# Altium project Stepper Motor Driver With L297 - l6201PS.PrjPCB
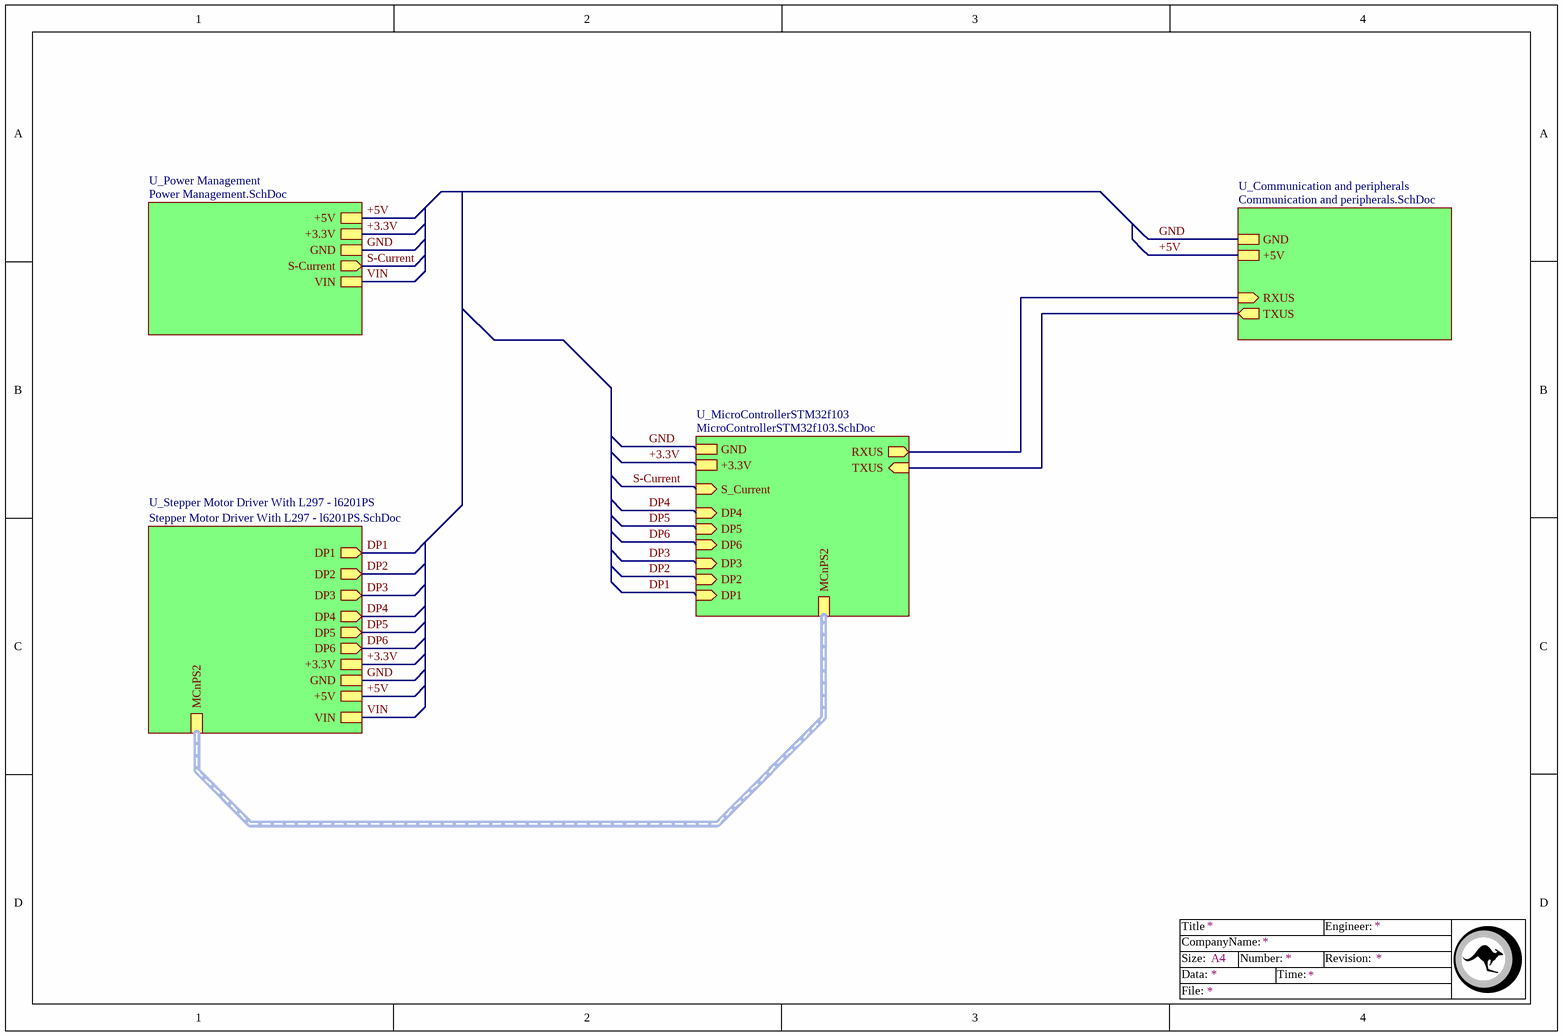
[diagram p0: A dashBoard of Stepper Motor Driver With L297 - l6201PS.SchDoc]
5 sheets, 90 parts. Net scope: hierarchical (ports join the sheet entries above them; power ports are global).
Board file: Stepper Motor Driver With L297 - l6201PS.PcbDoc
Sheets:
  A dashBoard of Stepper Motor Driver With L297 - l6201PS.SchDoc
    U_Communication and peripherals = Communication and peripherals.SchDoc
    U_Power Management = Power Management.SchDoc
    U_MicroControllerSTM32f103 = MicroControllerSTM32f103.SchDoc
    U_Stepper Motor Driver With L297 - l6201PS = Stepper Motor Driver With L297 - l6201PS.SchDoc

## Sheet A dashBoard of Stepper Motor Driver With L297 - l6201PS.SchDoc
size A4

### Sub-sheets
U_Communication and peripherals = Communication and peripherals.SchDoc: TXUS (out), RXUS (in), GND, +5V
U_MicroControllerSTM32f103 = MicroControllerSTM32f103.SchDoc: GND, +3.3V, RXUS (out), TXUS (in), DP4 (in), DP5 (in), DP6 (in), DP2 (in), DP1 (in), DP3 (in), MCnPS2 (harness MCnPS2), S_Current (in)
U_Power Management = Power Management.SchDoc: +5V, +3.3V, GND, S-Current (out), VIN
U_Stepper Motor Driver With L297 - l6201PS = Stepper Motor Driver With L297 - l6201PS.SchDoc: VIN, DP4 (out), DP5 (out), DP6 (out), GND, +3.3V, +5V, DP2 (out), DP1 (out), DP3 (out), MCnPS2 (harness MCnPS2)

### Nets
+3.3V: sheet U_Power Management/+3.3V, sheet U_MicroControllerSTM32f103/+3.3V, sheet U_Stepper Motor Driver With L297 - l6201PS/+3.3V
+5V: sheet U_Communication and peripherals/+5V, sheet U_Power Management/+5V, sheet U_Stepper Motor Driver With L297 - l6201PS/+5V
GND: sheet U_Communication and peripherals/GND, sheet U_Power Management/GND, sheet U_MicroControllerSTM32f103/GND, sheet U_Stepper Motor Driver With L297 - l6201PS/GND
VIN: sheet U_Power Management/VIN, sheet U_Stepper Motor Driver With L297 - l6201PS/VIN
DP1: sheet U_MicroControllerSTM32f103/DP1, sheet U_Stepper Motor Driver With L297 - l6201PS/DP1
DP2: sheet U_MicroControllerSTM32f103/DP2, sheet U_Stepper Motor Driver With L297 - l6201PS/DP2
DP3: sheet U_MicroControllerSTM32f103/DP3, sheet U_Stepper Motor Driver With L297 - l6201PS/DP3
DP4: sheet U_MicroControllerSTM32f103/DP4, sheet U_Stepper Motor Driver With L297 - l6201PS/DP4
DP5: sheet U_MicroControllerSTM32f103/DP5, sheet U_Stepper Motor Driver With L297 - l6201PS/DP5
DP6: sheet U_MicroControllerSTM32f103/DP6, sheet U_Stepper Motor Driver With L297 - l6201PS/DP6
RXUS: sheet U_Communication and peripherals/RXUS, sheet U_MicroControllerSTM32f103/RXUS
S-Current: sheet U_Power Management/S-Current, sheet U_MicroControllerSTM32f103/S_Current
TXUS: sheet U_Communication and peripherals/TXUS, sheet U_MicroControllerSTM32f103/TXUS

### Buses and harness runs
harness sheet U_MicroControllerSTM32f103/MCnPS2 = sheet U_Stepper Motor Driver With L297 - l6201PS/MCnPS2

### Notes on the sheet
- Title
- Size:
- Data:
- CompanyName:
- A4
- Number:
- Time:
- Revision:
- Engineer:
- File:

## Sheet Communication and peripherals.SchDoc
size A4
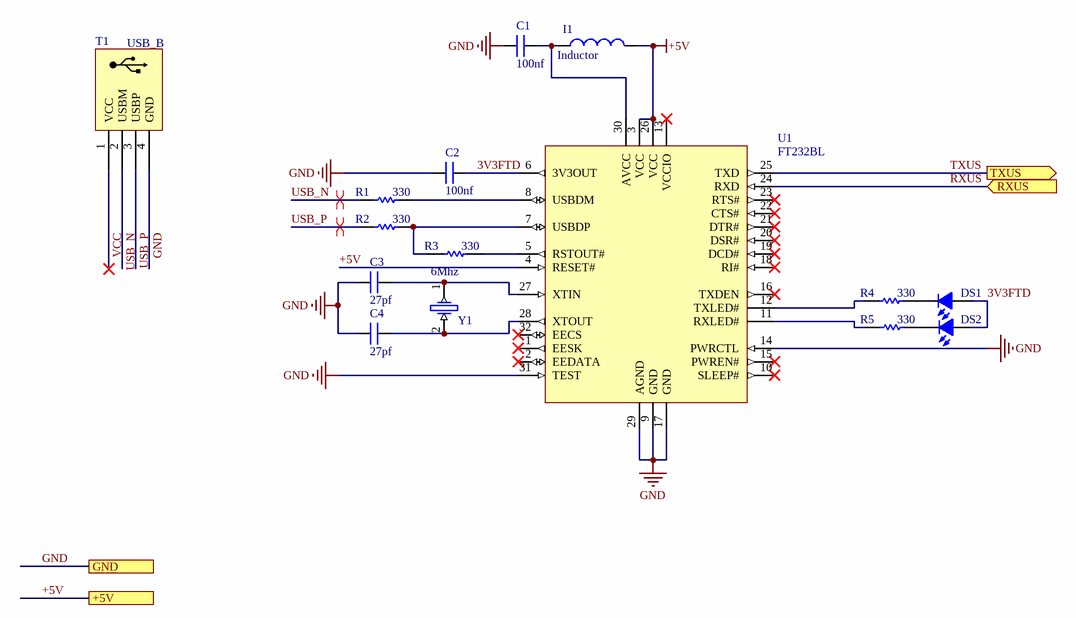
[diagram p1: Communication and peripherals.SchDoc]

### Parts
C1  100nf  [Cap0805]
C2  100nf  [Cap0805]
C3  27pf  [Cap0805]
C4  27pf  [Cap0805]
DS1  LED  [Led0805]  (value not drawn)
DS2  LED  [Led0805]  (value not drawn)
I1  Inductor  [1206]
R1  330  [R0805]
R2  330  [R0805]
R3  330  [R0805]
R4  330  [R0805]
R5  330  [R0805]
T1  USB_B  [USB_Dip_R]
U1  FT232BL  [LQFP-32_L]
Y1  6Mhz  [CrystallB]

### Ports
+5V, GND, RXUS (in), TXUS (out)

### Nets
+5V: I1.2 U1.3(VCC) U1.4(RESET#) U1.26(VCC) ; port +5V
GND: C1.2 C2.2 C3.1 C4.1 T1.4(GND) U1.9(GND) U1.14(PWRCTL) U1.17(GND) U1.29(AGND) U1.31(TEST) ; port GND
3V3FTD: C2.1 DS1.A DS2.A U1.6(3V3OUT)
RXUS: U1.24(RXD) ; port RXUS
TXUS: U1.25(TXD) ; port TXUS
USB_N: R1.1 T1.2(USBM)
USB_P: R2.1 T1.3(USBP)
VCC: T1.1(VCC)
NetC1_1: C1.1 I1.1 U1.30(AVCC)
NetC3_2: C3.2 U1.27(XTIN) Y1.1
NetC4_2: C4.2 U1.28(XTOUT) Y1.2
NetDS1_K: DS1.K R4.2
NetDS2_K: DS2.K R5.2
NetR1_2: R1.2 U1.8(USBDM)
NetR2_2: R2.2 R3.1 U1.7(USBDP)
NetR3_2: R3.2 U1.5(RSTOUT#)
NetR4_1: R4.1 U1.12(TXLED#)
NetR5_1: R5.1 U1.11(RXLED#)

Not connected (* = marked no-connect by the designer): U1 1(EESK)* 2(EEDATA)* 10(SLEEP#)* 13(VCCIO)* 15(PWREN#)* 16(TXDEN)* 18(RI#)* 19(DCD#)* 20(DSR#)* 21(DTR#)* 22(CTS#)* 23(RTS#)* 32(EECS)*

### Layout directives
differential pair: USB_N, USB_P

### Notes on the sheet
- Title
- Size:
- Data:
- CompanyName:
- A4
- Number:
- Time:
- Revision:
- Engineer:
- File:

### Library data of the parts
C1-C4 = Cap: Surface mount Capacitor
I1 = Inductor: Indicator
R1-R5 = Resistor
T1 = USB_B: USB B Connector
U1 = FT232BL: USB UART Asynchronous Serial Data Transfer Chip, LQFP-32, Pb-Free; DatasheetVersion: ver 2.2, Nov-2011; PackageVersion: 2010; PackageReference: LQFP-32; PackageDescription: 32-Pin Thin Quad Flat Pack 0.8 mm Pitch; ComponentLink1Description: Manufacturer URL; ComponentLink1URL: http://www.ftdichip.com/; ComponentLink2Description: Datasheet; ComponentLink2URL: http://www.ftdichip.com/Support/Documents/DataSheets/ICs/DS_FT232BL_BQ.pdf
Y1 = Crystal

## Sheet Power Management.SchDoc
size A4
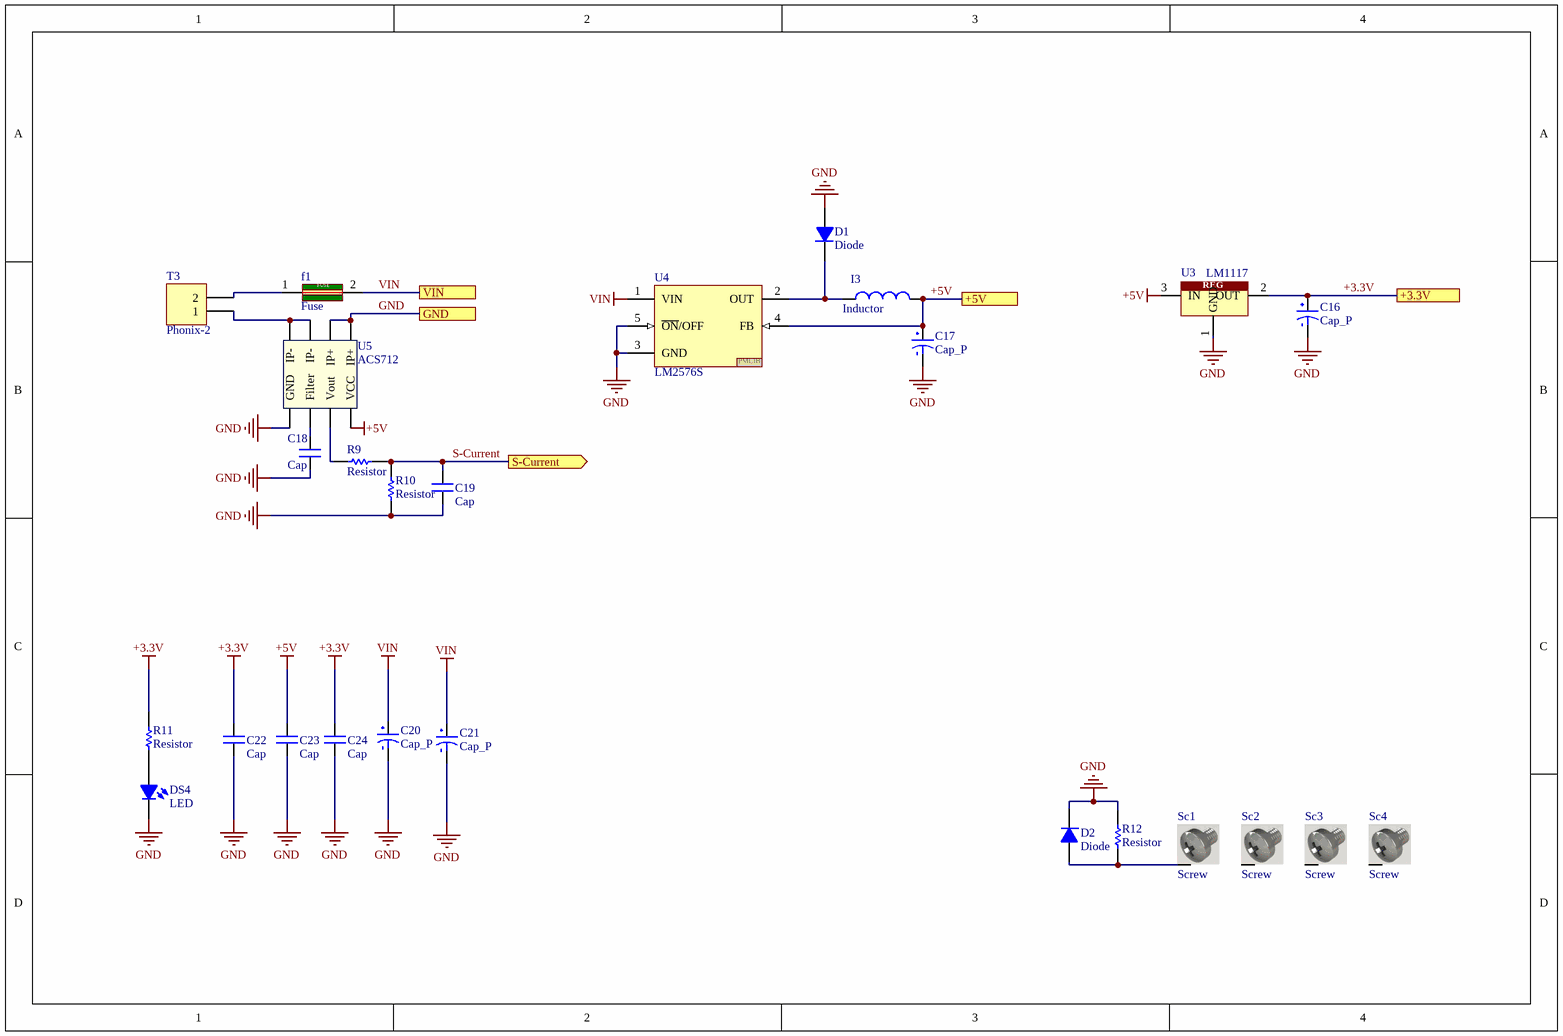
[diagram p2: Power Management.SchDoc]

### Parts
C16  Cap_P  [Cap_4mm]
C17  Cap_P  [Cap_4mm]
C18  Cap  [Cap0805]
C19  Cap  [Cap0805]
C20  Cap_P  [Cap_5mm]
C21  Cap_P  [Cap_5mm]
C22  Cap  [Cap0805]
C23  Cap  [Cap0805]
C24  Cap  [Cap0805]
D1  Diode  [Diod-1A-SMD]
D2  Diode  [Diod-1A-SMD]
DS4  LED  [Led0805]
f1  Fuse  [1206]
I3  Inductor  [Indicator_SMD]
R9  Resistor  [R0805]
R10  Resistor  [R0805]
R11  Resistor  [R0805]
R12  Resistor  [0603]
Sc1  Screw  [Screw]
Sc2  Screw  [Screw]
Sc3  Screw  [Screw]
Sc4  Screw  [Screw]
T3  Phonix-2  [Phonix-2]
U3  LM1117  [DPACK]
U4  LM2576S  [LM2576S]
U5  ACS712  [SOP8]

### Ports
+3.3V, +5V, GND, S-Current (out), VIN

### Nets
+3.3V: C16.2 C22.2 C24.2 R11.1 U3.2(OUT) ; port +3.3V
+5V: C17.2 C23.2 I3.2 U3.3(IN) U4.4(FB) U5.8(VCC) ; port +5V
GND: C16.1 C17.1 C18.1 C19.1 C20.1 C21.1 C22.1 C23.1 C24.1 D1.A D2.K DS4.K R10.2 R12.1 U3.1(GND) U4.3(GND) U4.5(~{ON}/OFF) U5.1(IP+) U5.2(IP+) U5.5(GND) ; port GND
VIN: C20.2 C21.2 f1.2(OUT) U4.1(VIN) ; port VIN
S-Current: C19.2 R9.1 R10.1 ; port S-Current
NetC18_2: C18.2 U5.6(Filter)
NetD1_K: D1.K I3.1 U4.2(OUT)
NetD2_A: D2.A R12.2 Sc1.S
NetDS4_A: DS4.A R11.2
Netf1_1: f1.1(IN) T3.2
NetR9_2: R9.2 U5.7(Vout)
NetT3_1: T3.1 U5.3(IP-) U5.4(IP-)

Not connected (* = marked no-connect by the designer): Sc2 S; Sc3 S; Sc4 S

### Notes on the sheet
- Title
- Size:
- Data:
- CompanyName:
- A4
- Number:
- Time:
- Revision:
- Engineer:
- File:
- (in symbol Fuse) FUSE
- (in symbol LM1117) REG
- (in symbol LM2576S) PMLIB

### Library data of the parts
C16 C17 C20 C21 = Cap_P: Polarity
C18 C19 C22-C24 = Cap: Surface mount Capacitor
I3 = Inductor: Indicator
Sc1-Sc4 = Screw: Screw 3mm
T3 = Phonix-2: Connector
U3 = LM1117: Regulator
U4 = LM2576S: Regulator
U5 = ACS712: Hall effect Current Sensor

## Sheet MicroControllerSTM32f103.SchDoc
size A4
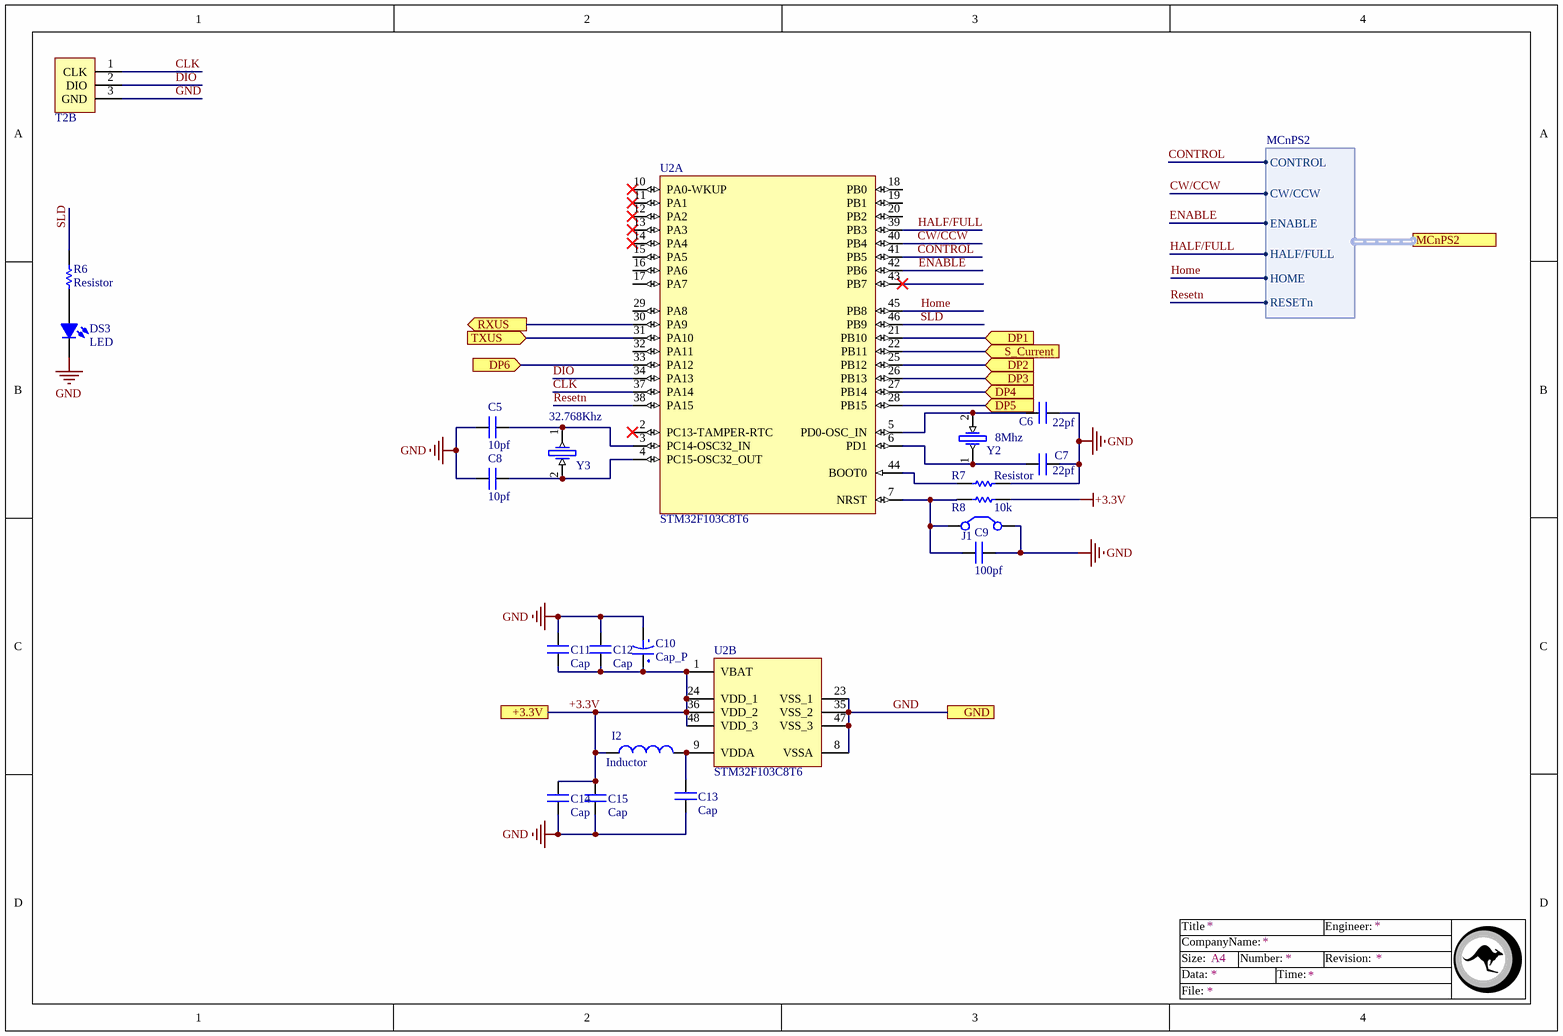
[diagram p3: MicroControllerSTM32f103.SchDoc]

### Parts
C5  10pf  [Cap0805]
C6  22pf  [Cap0805]
C7  22pf  [Cap0805]
C8  10pf  [Cap0805]
C9  100pf  [Cap0805]
C10  Cap_P  [CAPMOL_C]
C11  Cap  [Cap0805]
C12  Cap  [Cap0805]
C13  Cap  [Cap0805]
C14  Cap  [Cap0805]
C15  Cap  [Cap0805]
DS3  LED  [Led0805]
I2  Inductor  [1206]
J1  Jumper  [Jumper SMD - Small]  (value not drawn)
R6  Resistor  [R0805]
R7  Resistor  [R0805]
R8  10k  [R0805]
T2  Serial Program  [MHDR1X03-254P - E]  (value not drawn)  (part B of 2)
U2  STM32F103C8T6  [LQFP48_L]  (parts A,B of 2)
Y2  8Mhz  [CrystallB]
Y3  32.768Khz  [CrystallB]

### Ports
+3.3V, DP1 (in), DP2 (in), DP3 (in), DP4 (in), DP5 (in), DP6 (in), GND, MCnPS2 (harness MCnPS2), RXUS (out), S_Current (in), TXUS (in)

### Harnesses
MCnPS2: CONTROL, CW/CCW, ENABLE, HALF/FULL, HOME, RESETn

### Nets
+3.3V: C10.2 C11.1 C12.1 C14.2 C15.2 I2.1 R8.1 U2.1(VBAT) U2.24(VDD_1) U2.36(VDD_2) U2.48(VDD_3) ; port +3.3V
GND: C5.1 C6.1 C7.1 C8.1 C9.2 C10.1 C11.2 C12.2 C13.1 C14.1 C15.1 DS3.K J1.2(C2) R7.2 T2.3(GND) U2.8(VSSA) U2.23(VSS_1) U2.35(VSS_2) U2.47(VSS_3) ; port GND
CLK: T2.1(CLK) U2.37(PA14)
CONTROL: U2.41(PB5) ; port MCnPS2.CONTROL
CW/CCW: U2.40(PB4) ; port MCnPS2.CW/CCW
DIO: T2.2(DIO) U2.34(PA13)
DP1: U2.21(PB10) ; port DP1
DP2: U2.25(PB12) ; port DP2
DP3: U2.26(PB13) ; port DP3
DP4: U2.27(PB14) ; port DP4
DP5: U2.28(PB15) ; port DP5
DP6: U2.33(PA12) ; port DP6
ENABLE: U2.42(PB6) ; port MCnPS2.ENABLE
HALF/FULL: U2.39(PB3) ; port MCnPS2.HALF/FULL
Home: U2.45(PB8) ; port MCnPS2.HOME
Resetn: U2.38(PA15) ; port MCnPS2.RESETn
RXUS: U2.30(PA9) ; port RXUS
S-Current: U2.22(PB11) ; port S_Current
SLD: R6.1 U2.46(PB9)
TXUS: U2.31(PA10) ; port TXUS
NetC5_2: C5.2 U2.3(PC14-OSC32_IN) Y3.1
NetC6_2: C6.2 U2.5(PD0-OSC_IN) Y2.2
NetC7_2: C7.2 U2.6(PD1) Y2.1
NetC8_2: C8.2 U2.4(PC15-OSC32_OUT) Y3.2
NetC9_1: C9.1 J1.1(C1) R8.2 U2.7(NRST)
NetC13_2: C13.2 I2.2 U2.9(VDDA)
NetDS3_A: DS3.A R6.2
NetR7_1: R7.1 U2.44(BOOT0)

Not connected (* = marked no-connect by the designer): U2 2(PC13-TAMPER-RTC)* 10(PA0-WKUP)* 11(PA1)* 12(PA2)* 13(PA3)* 14(PA4)* 15(PA5) 16(PA6) 17(PA7) 18(PB0) 19(PB1) 20(PB2) 29(PA8) 32(PA11) 43(PB7)*

### Notes on the sheet
- Title
- Size:
- Data:
- CompanyName:
- A4
- Number:
- Time:
- Revision:
- Engineer:
- File:

### Library data of the parts
C5-C9 C11-C15 = Cap: Surface mount Capacitor
C10 = Cap_P: Polarity
I2 = Inductor: Indicator
R8 = Resistor
T2 = Serial Program: STM Serial Program pin
U2 = STM32F103C8T6: STM32 ARM-based 32-bit MCU Performance Line with 64 kB Flash, 20 kB Internal RAM, -40 to +85°C Temperature, 48-Pin LQFP, Tray; DatasheetVersion: rev13.0, Apr-2011; PackageVersion: rev13, Apr-2011; PackageReference: LQFP48; PackageDescription: 48-Pin Low-Profile Quad Flat Pack, 7 x 7 mm Body, 0.5 mm Pitch (LQFP48); ComponentLink1Description: Manufacturer URL; ComponentLink1URL: http://www.st.com/; ComponentLink2Description: STM32F103 Datasheet; ComponentLink2URL: http://www.st.com/internet/com/TECHNICAL_RESOURCES/TECHNICAL_LITERATURE/DATASHEET/CD00161566.pdf; ComponentLink3Description: STM32 Family Web Page; ComponentLink3URL: www.st.com/stm32
Y2 Y3 = Crystal

## Sheet Stepper Motor Driver With L297 - l6201PS.SchDoc
size A4
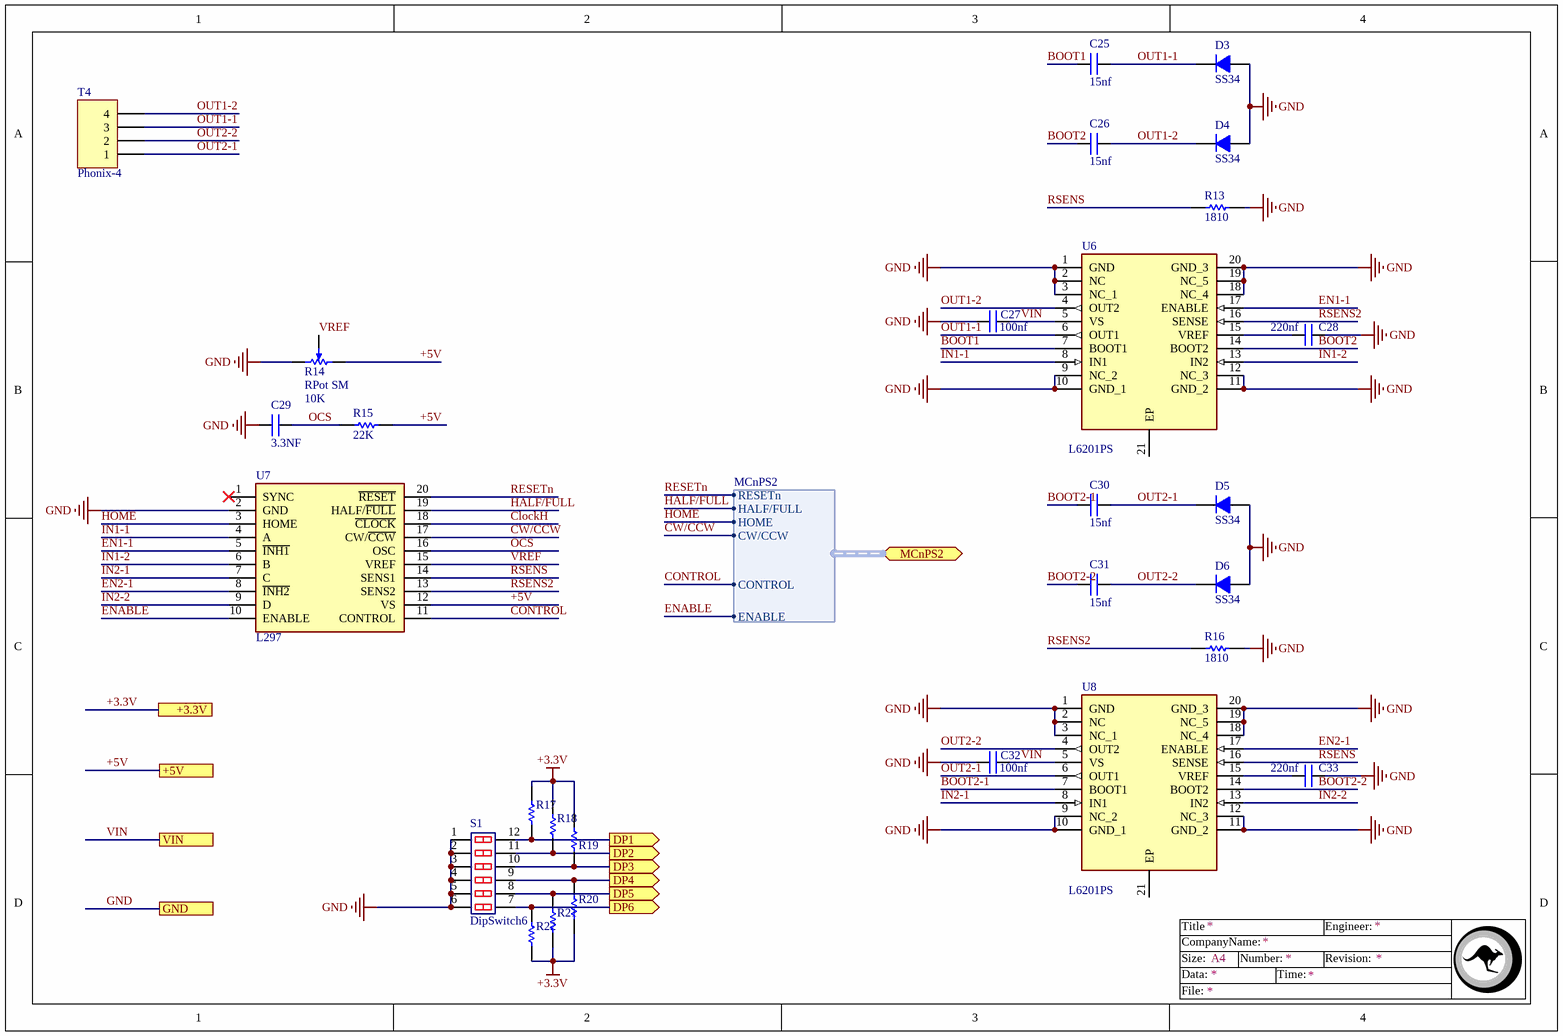
[diagram p4: Stepper Motor Driver With L297 - l6201PS.SchDoc]

### Parts
C25  15nf  [Cap0805]
C26  15nf  [Cap0805]
C27  100nf  [Cap0805]
C28  220nf  [Cap0805]
C29  3.3NF  [Cap0805]
C30  15nf  [Cap0805]
C31  15nf  [Cap0805]
C32  100nf  [Cap0805]
C33  220nf  [Cap0805]
D3  SS34  [Diod-1A-SMD]
D4  SS34  [Diod-1A-SMD]
D5  SS34  [Diod-1A-SMD]
D6  SS34  [Diod-1A-SMD]
R13  1810  [RES1812]
R14  RPot SM  value 10K  [POT4MM-Small Pot]
R15  22K  [R0805]
R16  1810  [RES1812]
R17  Resistor  [R0805]  (value not drawn)
R18  Resistor  [R0805]  (value not drawn)
R19  Resistor  [R0805]  (value not drawn)
R20  Resistor  [R0805]  (value not drawn)
R21  Resistor  [R0805]  (value not drawn)
R22  Resistor  [R0805]  (value not drawn)
S1  DipSwitch6  [DIPSW6]
T4  Phonix-4  [Phonix-4]
U6  L6201PS  [SOIC127P1420X360-21N]
U7  L297  [SOIC127P1032X265-20N]
U8  L6201PS  [SOIC127P1420X360-21N]

### Ports
+3.3V, +5V, DP1 (out), DP2 (out), DP3 (out), DP4 (out), DP5 (out), DP6 (out), GND, MCnPS2 (bidir, harness MCnPS2), VIN

### Harnesses
MCnPS2: RESETn, HALF/FULL, HOME, CW/CCW, CONTROL, ENABLE

### Nets
+3.3V: R17.1 R18.1 R19.2 R20.2 R21.2 R22.2 ; port +3.3V
+5V: R14.CCW(-) R15.1 U7.12(VS) ; port +5V
GND: C27.1 C28.2 C29.2 C32.1 C33.2 D3.A D4.A D5.A D6.A R13.1 R14.CW(+) R16.1 S1.1 S1.2 S1.3 S1.4 S1.5 S1.6 U6.1(GND) U6.2(NC) U6.3(NC_1) U6.9(NC_2) U6.10(GND_1) U6.11(GND_2) U6.12(NC_3) U6.18(NC_4) U6.19(NC_5) U6.20(GND_3) U7.2(GND) U8.1(GND) U8.2(NC) U8.3(NC_1) U8.9(NC_2) U8.10(GND_1) U8.11(GND_2) U8.12(NC_3) U8.18(NC_4) U8.19(NC_5) U8.20(GND_3) ; port GND
VIN: C27.2 C32.2 U6.5(VS) U8.5(VS) ; port VIN
BOOT1: C25.2 U6.7(BOOT1)
BOOT2: C26.2 U6.14(BOOT2)
BOOT2-1: C30.2 U8.7(BOOT1)
BOOT2-2: C31.2 U8.14(BOOT2)
ClockH: U7.18(~{CLOCK})
CONTROL: U7.11(CONTROL) ; port MCnPS2.CONTROL
CW/CCW: U7.17(CW/~{CCW}) ; port MCnPS2.CW/CCW
DP1: R17.2 S1.12 ; port DP1
DP2: R18.2 S1.11 ; port DP2
DP3: R19.1 S1.10 ; port DP3
DP4: R20.1 S1.9 ; port DP4
DP5: R21.1 S1.8 ; port DP5
DP6: R22.1 S1.7 ; port DP6
EN1-1: U6.17(ENABLE) U7.5(~{INH1})
EN2-1: U7.8(~{INH2}) U8.17(ENABLE)
ENABLE: U7.10(ENABLE) ; port MCnPS2.ENABLE
HALF/FULL: U7.19(HALF/~{FULL}) ; port MCnPS2.HALF/FULL
Home: U7.3(HOME) ; port MCnPS2.HOME
IN1-1: U6.8(IN1) U7.4(A)
IN1-2: U6.13(IN2) U7.6(B)
IN2-1: U7.7(C) U8.8(IN1)
IN2-2: U7.9(D) U8.13(IN2)
OCS: C29.1 R15.2 U7.16(OSC)
OUT1-1: C25.1 D3.K T4.3 U6.6(OUT1)
OUT1-2: C26.1 D4.K T4.4 U6.4(OUT2)
OUT2-1: C30.1 D5.K T4.1 U8.6(OUT1)
OUT2-2: C31.1 D6.K T4.2 U8.4(OUT2)
Resetn: U7.20(~{RESET}) ; port MCnPS2.RESETn
RSENS: R13.2 U7.14(SENS1) U8.16(SENSE)
RSENS2: R16.2 U6.16(SENSE) U7.13(SENS2)
VREF: R14.W U7.15(VREF)
NetC28_1: C28.1 U6.15(VREF)
NetC33_1: C33.1 U8.15(VREF)

Not connected (* = marked no-connect by the designer): U6 21(EP); U7 1(SYNC)*; U8 21(EP)

### Notes on the sheet
- Title
- Size:
- Data:
- CompanyName:
- A4
- Number:
- Time:
- Revision:
- Engineer:
- File:

### Library data of the parts
C25-C33 = Cap: Surface mount Capacitor
D3-D6 = Diode
R13 R15 R16 = Resistor
R14 = RPot SM: Square Trimming Potentiometer; Published: 17-Dec-2003; DatasheetVersion: Oct-2003; PackageReference: POT4MM-2; Publisher: Altium Limited; PackageDescription: Square Trimming Potentiometer; ComponentLink1Description: Manufacturer Link; ComponentLink1URL: http://bourns.com/2/search.html
S1 = DipSwitch6: DipSwitch6pin
T4 = Phonix-4: Connector
U6 U8 = L6201PS: High voltage, high current dual full-bridge driver
U7 = L297: Stepper Motor Controller IC

## Nets that join several sheets
+3.3V: Power Management (5 pins), MicroControllerSTM32f103 (11 pins), Stepper Motor Driver With L297 - l6201PS (6 pins)
+5V: Communication and peripherals (I1.2 U1.3 U1.4 U1.26), Power Management (6 pins), Stepper Motor Driver With L297 - l6201PS (R14.CCW R15.1 U7.12)
GND: Communication and peripherals (10 pins), Power Management (20 pins), MicroControllerSTM32f103 (19 pins), Stepper Motor Driver With L297 - l6201PS (39 pins)
VIN: Power Management (C20.2 C21.2 f1.2 U4.1), Stepper Motor Driver With L297 - l6201PS (C27.2 C32.2 U6.5 U8.5)
CONTROL: MicroControllerSTM32f103 (U2.41), Stepper Motor Driver With L297 - l6201PS (U7.11)
CW/CCW: MicroControllerSTM32f103 (U2.40), Stepper Motor Driver With L297 - l6201PS (U7.17)
DP1: MicroControllerSTM32f103 (U2.21), Stepper Motor Driver With L297 - l6201PS (R17.2 S1.12)
DP2: MicroControllerSTM32f103 (U2.25), Stepper Motor Driver With L297 - l6201PS (R18.2 S1.11)
DP3: MicroControllerSTM32f103 (U2.26), Stepper Motor Driver With L297 - l6201PS (R19.1 S1.10)
DP4: MicroControllerSTM32f103 (U2.27), Stepper Motor Driver With L297 - l6201PS (R20.1 S1.9)
DP5: MicroControllerSTM32f103 (U2.28), Stepper Motor Driver With L297 - l6201PS (R21.1 S1.8)
DP6: MicroControllerSTM32f103 (U2.33), Stepper Motor Driver With L297 - l6201PS (R22.1 S1.7)
ENABLE: MicroControllerSTM32f103 (U2.42), Stepper Motor Driver With L297 - l6201PS (U7.10)
HALF/FULL: MicroControllerSTM32f103 (U2.39), Stepper Motor Driver With L297 - l6201PS (U7.19)
Home: MicroControllerSTM32f103 (U2.45), Stepper Motor Driver With L297 - l6201PS (U7.3)
Resetn: MicroControllerSTM32f103 (U2.38), Stepper Motor Driver With L297 - l6201PS (U7.20)
RXUS: Communication and peripherals (U1.24), MicroControllerSTM32f103 (U2.30)
S-Current: Power Management (C19.2 R9.1 R10.1), MicroControllerSTM32f103 (U2.22)
TXUS: Communication and peripherals (U1.25), MicroControllerSTM32f103 (U2.31)